# EAGLE design BATTERIES_CONTROLLER (EAGLE 9.0.0)
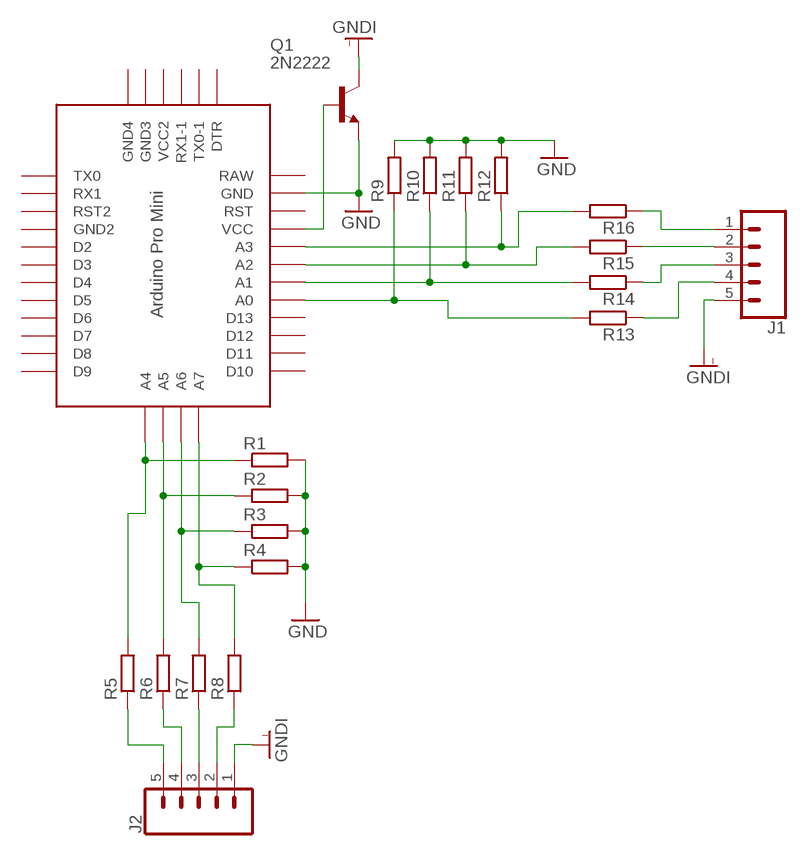
[diagram p0: schematic, sheet 1]

## Parts
J1  CONN_05  [1X05]
J2  CONN_05  [1X05]
Q1  2N2222  [TO18]
R1  R-EU_0204/7  [0204/7]
R2  R-EU_0204/7  [0204/7]
R3  R-EU_0204/7  [0204/7]
R4  R-EU_0204/7  [0204/7]
R5  R-EU_0204/7  [0204/7]
R6  R-EU_0204/7  [0204/7]
R7  R-EU_0204/7  [0204/7]
R8  R-EU_0204/7  [0204/7]
R9  R-EU_0204/7  [0204/7]
R10  R-EU_0204/7  [0204/7]
R11  R-EU_0204/7  [0204/7]
R12  R-EU_0207/10  [0207/10]
R13  R-EU_0204/7  [0204/7]
R14  R-EU_0204/7  [0204/7]
R15  R-EU_0204/7  [0204/7]
R16  R-EU_0204/7  [0204/7]
U$1  PRO-MINI  [PRO-MINI]

## Nets
GND: Q1.1(E) R1.2 R2.2 R3.2 R4.2 R9.2 R10.2 R11.2 R12.2 U$1.GND
GNDI: J1.5 J2.1 Q1.3(C)
N$1: R1.1 R5.2 U$1.A4
N$2: R2.1 R6.2 U$1.A5
N$3: R3.1 R7.2 U$1.A6
N$4: R4.1 R8.2 U$1.A7
N$5: J2.5 R5.1
N$6: J2.4 R6.1
N$7: J2.3 R7.1
N$8: J2.2 R8.1
N$9: R9.1 R13.2 U$1.A0
N$10: R10.1 R14.2 U$1.A1
N$11: R11.1 R15.2 U$1.A2
N$12: R12.1 R16.2 U$1.A3
N$13: J1.4 R13.1
N$14: J1.3 R14.1
N$15: J1.2 R15.1
N$16: J1.1 R16.1
N$18: Q1.2(B) U$1.VCC
Unconnected: U$1.D2 U$1.D3 U$1.D4 U$1.D5 U$1.D6 U$1.D7 U$1.D8 U$1.D9 U$1.D10 U$1.D11 U$1.D12 U$1.D13 U$1.DTR U$1.GND1(GND2) U$1.GND2(GND4) U$1.GND3 U$1.RST U$1.RST1(RST2) U$1.RX1 U$1.RX1-1 U$1.TX0 U$1.TX0-1 U$1.VCC1(VCC2)

## Power pins joined to a net without a drawn wire
RAW: U$1.RAW

## Library data of the parts
J1 J2 = SparkFun-Connectors:CONN_05: Multi connection point. Often used as Generic Header-pin footprint for 0.1 inch spaced/style header connections On any of the 0.1 inch spaced packages, you can populate with these: Break Away Headers - Straight <https://www.sparkfun.com/products/116> (PRT-00116) Break Away Male Headers - Right Angle <https://www.sparkfun.com/products/553> (PRT-00553) Female Headers <https://www.sparkfun.com/products/115> (PRT-00115) Break Away Headers - Machine Pin <https://www.sparkfun.com/products/117> (PRT-00117) Break Away Female Headers - Swiss Machine Pin <https://www.sparkfun.com/products/743> (PRT-00743) For SCREWTERMINALS and SPRING TERMINALS visit here: Screw Terimnals on SparkFun.com <https://www.sparkfun.com/search/results?term=Screw+Terminals> (5mm/3.5mm/2.54mm spacing) This device is also useful as a general connection point to wire up your design to another part of your project. Our various solder wires solder well into these plated through hole pads. Hook-Up Wire - Assortment (Stranded, 22 AWG) <https://www.sparkfun.com/products/11375> (PRT-11375) Hook-Up Wire - Assortment (Solid Core, 22 AWG) <https://www.sparkfun.com/products/11367> (PRT-11367) View the entire wire category on our website here <https://www.sparkfun.com/categories/141> Special notes: Molex polarized connector foot print use with SKU : PRT-08231 with associated crimp pins and housings. 1MM SMD Version SKU: PRT-10208
Q1 = transistor-npn:2N2222*: NPN Transistor
R1-R16 = resistor:R-EU_: RESISTOR, European symbol
U$1 = Arduino-clone:PRO-MINI: Arduion Pro Mini Clone V1.0 www.betemcu.cu

## Board
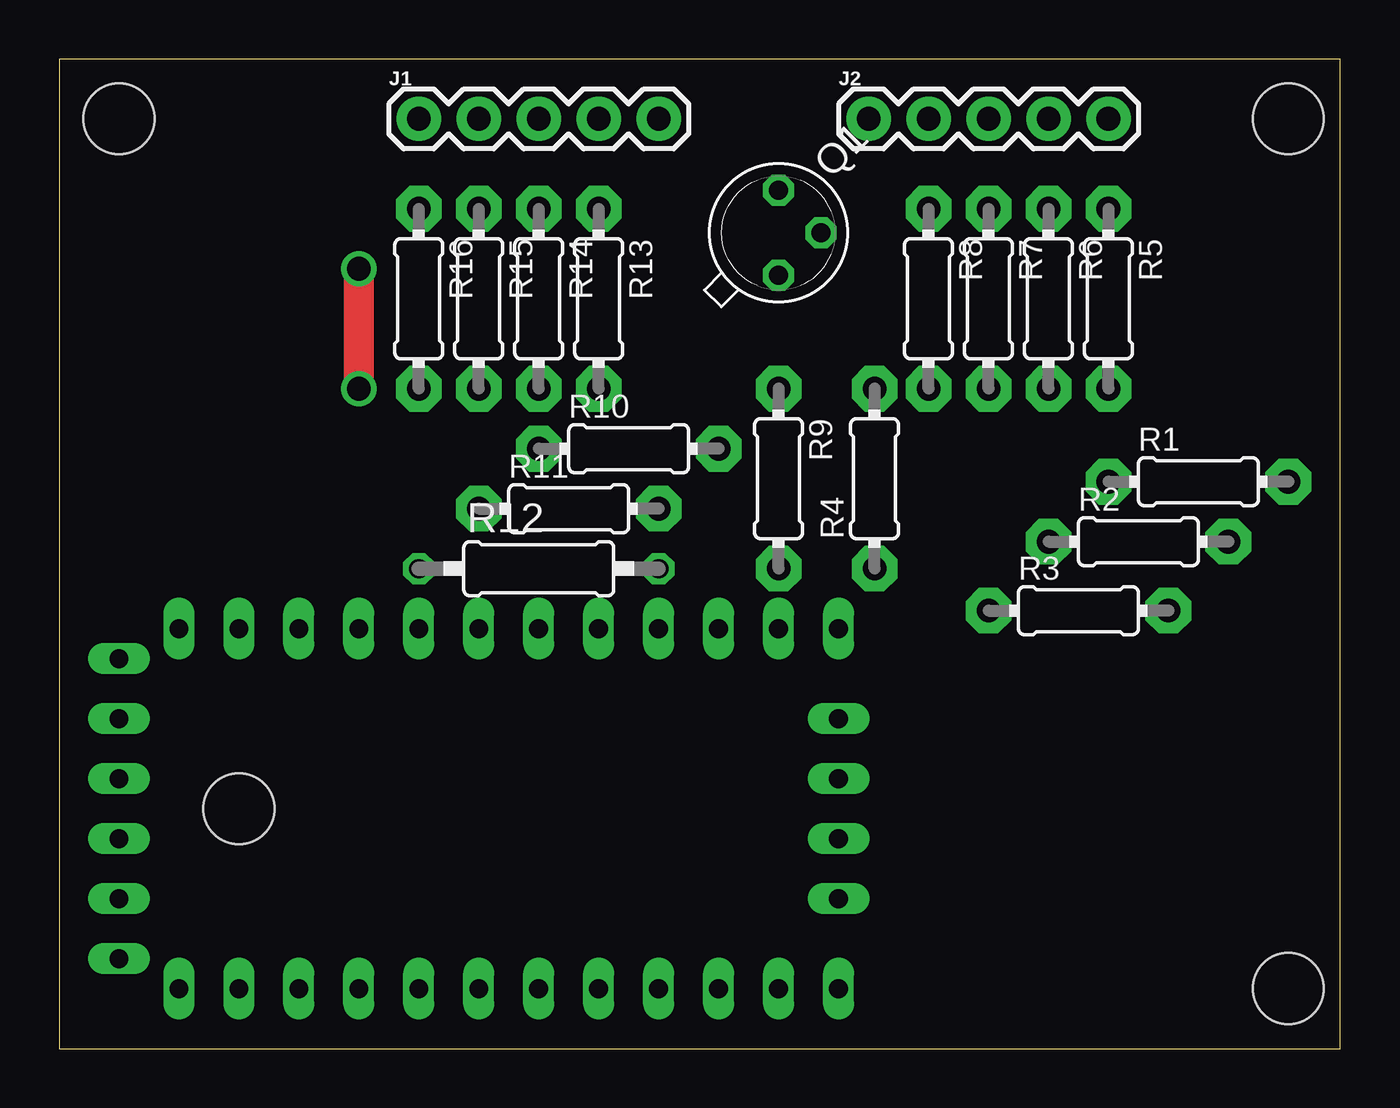
[diagram p1: board, top side]
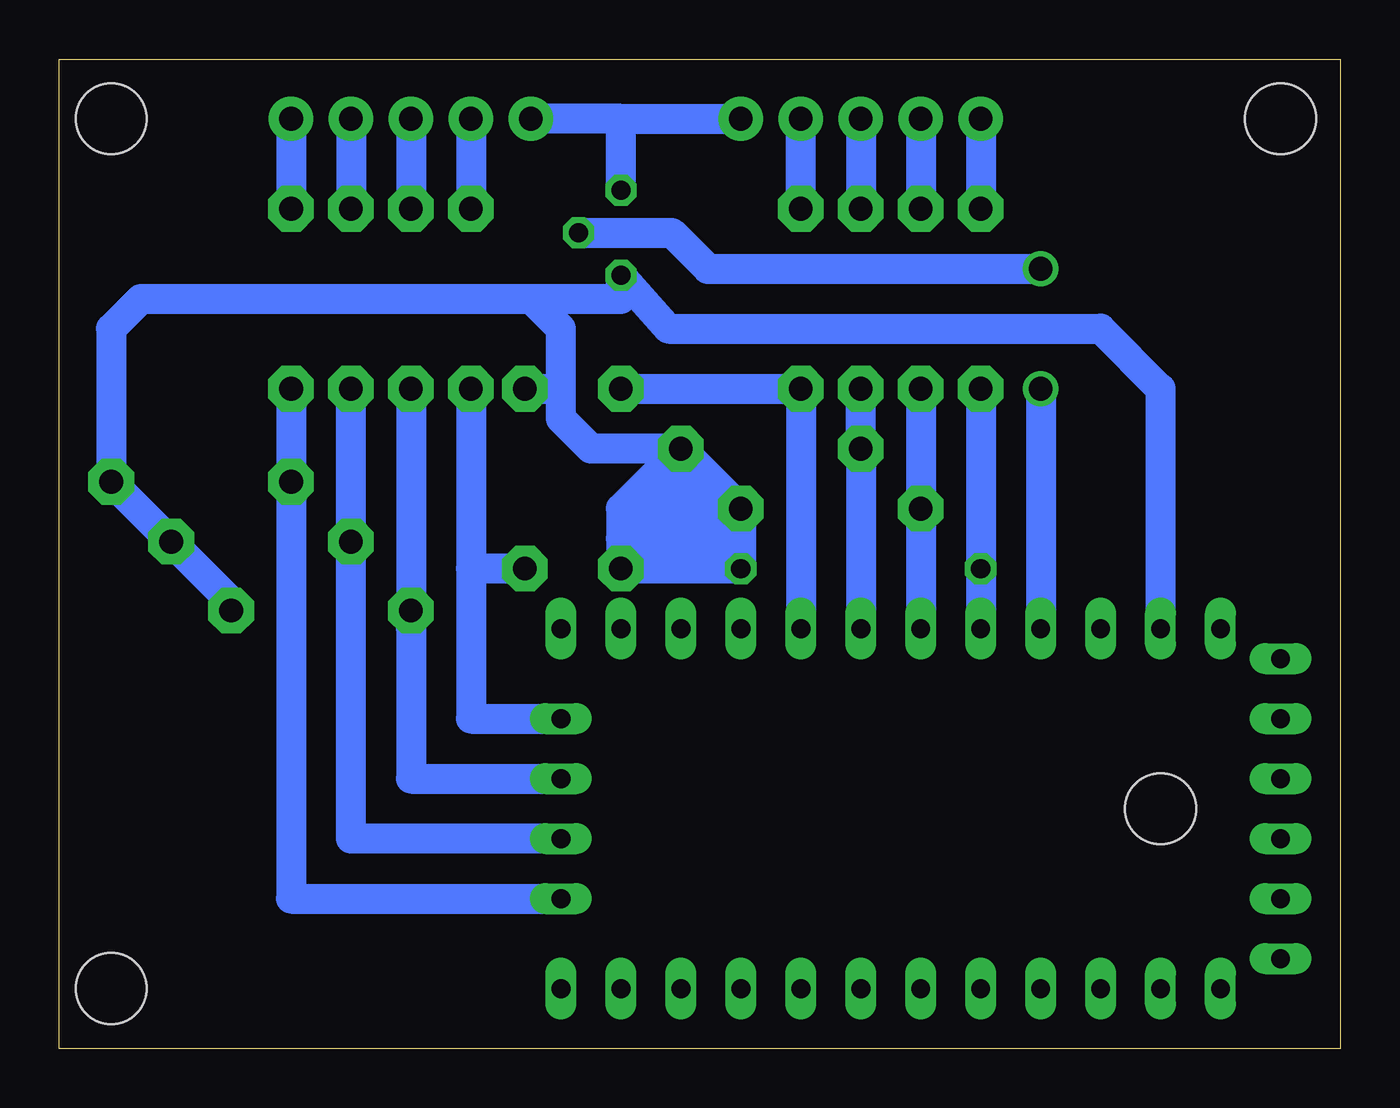
[diagram p2: board, bottom side, seen from below]

Size 54.28 x 41.9 mm. Coordinates in mm from the lower left corner, seen from the top.
Outline: 0,0 54.28,0 54.28,41.9 0,41.9 0,0
Copper layers (1*16): Top 0.035mm / dielectric 1.5mm / Bottom 0.035mm
Design rules "default": minimum track width 6mil, minimum drill 0.35mm, track to track 6mil, track to pad 6mil, pad to pad 6mil, via to via 6mil, smd to smd 6mil, copper to edge 40mil, drill to drill 6mil, minimum pad ring 10mil, minimum via ring 8mil, stop-mask expansion 4mil, vias tented up to drill 0mil, thermal gap 10mil
Holes 3 mm at 2.54,39.37 52.07,39.37 52.07,2.54 7.62,10.16

### Footprints (pad centres in the part's own frame; a part is rotated, then mirrored left to right if it is on the bottom)
1X05 = drill 1 pad 1.88: 1 0,0; 2 2.54,0; 3 5.08,0; 4 7.62,0; 5 10.16,0
TO18 = drill 0.813 octagon: 1 -1.27,-1.27; 2 1.27,-1.27; 3 1.27,1.27
0204/7 = drill 1 pad 1.93 octagon: 1 -3.81,0; 2 3.81,0
0207/10 = drill 0.813 octagon: 1 -5.08,0; 2 5.08,0
PRO-MINI = drill 0.8 long: A0 8.89,8.89; A1 8.89,11.43; A2 8.89,13.97; A3 8.89,16.51; A4 -2.54,-1.27; A5 0,-1.27; A6 2.54,-1.27; A7 5.08,-1.27; D2 -6.35,16.51; D3 -6.35,13.97; D4 -6.35,11.43; D5 -6.35,8.89; D6 -6.35,6.35; D7 -6.35,3.81; D8 -6.35,1.27; D9 -6.35,-1.27; D10 8.89,-1.27; D11 8.89,1.27; D12 8.89,3.81; D13 8.89,6.35; DTR 7.62,29.21; GND 8.89,24.13; GND1 -6.35,19.05; GND2 -5.08,29.21; GND3 -2.54,29.21; RAW 8.89,26.67; RST 8.89,21.59; RST1 -6.35,21.59; RX1 -6.35,24.13; RX1-1 2.54,29.21; TX0 -6.35,26.67; TX0-1 5.08,29.21; VCC 8.89,19.05; VCC1 0,29.21

### Placement (x,y rotation side)
J1  15.24,39.37 0 top
J2  34.29,39.37 0 top
Q1  30.48,34.54 45 top
R1  48.26,24 0 top
R2  45.72,21.46 0 top
R3  43.18,18.54 0 top
R4  34.54,24.13 90 top
R5  44.45,31.75 270 top
R6  41.91,31.75 270 top
R7  39.37,31.75 270 top
R8  36.83,31.75 270 top
R9  30.48,24.13 270 top
R10  24.13,25.4 0 top
R11  21.59,22.86 0 top
R12  20.32,20.32 0 top
R13  22.86,31.75 270 top
R14  20.32,31.75 270 top
R15  17.78,31.75 270 top
R16  15.24,31.75 270 top
U$1  31.75,8.89 90 top

### Tracks (layer width: path | path; a pad name or v marks a point on that pad's centre or on a via)
GND
  Bottom 1.27: R10.2 R11.2 | R11.2 R12.2 26.67,20.32 | 26.67,20.32 27.94,20.32 | 27.94,20.32 29.21,20.32 | 29.21,20.32 R9.2 30.48,21.59 | R10.2 30.48,22.86 | 30.48,22.86 30.48,21.59 | 30.48,22.86 29.21,22.86 | 29.21,22.86 27.94,22.86 | 27.94,22.86 26.67,22.86 | 26.67,22.86 R11.2 | R10.2 27.94,24.13 | 27.94,24.13 27.94,22.86 | 26.67,22.86 27.94,24.13 | 27.94,24.13 29.21,22.86 | R11.2 26.67,21.59 26.67,20.32 | 26.67,22.86 27.94,21.59 27.94,20.32 | 27.94,22.86 29.21,21.59 29.21,20.32 | 30.48,21.59 29.21,22.86 | R10.2 31.75,25.4 33.02,26.67 33.02,27.94 | 33.02,27.94 33.02,30.48 34.29,31.75 | 34.29,31.75 50.8,31.75 52.07,30.48 R1.2 R2.2 46.99,18.92 R3.2 | U$1.GND 7.62,27.94 10.16,30.48 28.47,30.48 Q1.1 30.48,31.75 34.29,31.75 | R4.2 33.02,27.94
GNDI
  Bottom 1.27: Q1.3 30.48,39.37 | 30.48,39.37 J1.5 | 30.48,39.37 J2.1
N$1
  Bottom 1.27: R5.2 44.45,24.13 R1.1 44.45,6.35 U$1.A4
N$2
  Bottom 1.27: R6.2 41.91,21.59 R2.1 41.91,8.89 U$1.A5
N$3
  Bottom 1.27: R7.2 R3.1 39.37,17.78 39.37,11.43 U$1.A6
N$4
  Bottom 1.27: R8.2 36.83,20.32 | 36.83,20.32 36.83,13.97 U$1.A7 | R4.1 36.83,20.32
N$5
  Bottom 1.27: J2.5 R5.1
N$6
  Bottom 1.27: J2.4 R6.1
N$7
  Bottom 1.27: J2.3 R7.1
N$8
  Bottom 1.27: J2.2 R8.1
N$9
  Bottom 1.27: U$1.A0 R13.2 R9.1
N$10
  Bottom 1.27: U$1.A1 R10.1 R14.2
N$11
  Bottom 1.27: R15.2 R11.1 U$1.A2
N$12
  Bottom 1.27: R16.2 U$1.A3 R12.1
N$13
  Bottom 1.27: R13.1 J1.4
N$14
  Bottom 1.27: J1.3 R14.1
N$15
  Bottom 1.27: J1.2 R15.1
N$16
  Bottom 1.27: J1.1 R16.1
N$18  (via drill 1)
  Top 1.27: v12.7,33.02 v12.7,27.94
  Bottom 1.27: Q1.2 28.32,34.54 26.8,33.02 v12.7,33.02 | v12.7,27.94 U$1.VCC